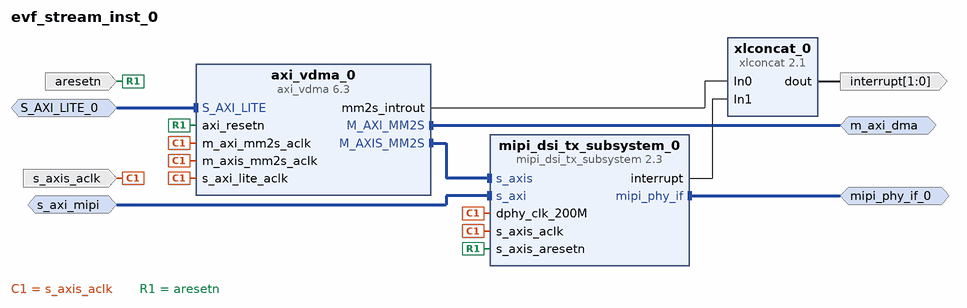
[diagram p0: block diagram of the top level]
# Vivado block design evf_stream_inst_0, xc7z014sclg484-1, Vivado 2023.1
create_bd_design evf_stream_inst_0

create_bd_intf_port -mode Master -vlnv xilinx.com:interface:mipi_phy_rtl:1.0 mipi_phy_if_0
create_bd_intf_port -mode Master -vlnv xilinx.com:interface:aximm_rtl:1.0 m_axi_dma
create_bd_intf_port -mode Slave -vlnv xilinx.com:interface:aximm_rtl:1.0 s_axi_mipi
create_bd_intf_port -mode Slave -vlnv xilinx.com:interface:aximm_rtl:1.0 S_AXI_LITE_0
create_bd_port -dir O -from 1 -to 0 interrupt
create_bd_port -dir I -type rst aresetn
create_bd_port -dir I -type clk s_axis_aclk

create_bd_cell -type ip -vlnv xilinx.com:ip:mipi_dsi_tx_subsystem:2.3 mipi_dsi_tx_subsystem_0
set_property -dict [list \
  CONFIG.C_EN_7S_LINERATE_CHECK true \
  CONFIG.C_EN_HS_OBUFTDS false \
  CONFIG.C_INCLUDE_DCS_CMD_MODE false \
  CONFIG.DPHY_EN_REG_IF false \
  CONFIG.DSI_DATATYPE RGB888 \
  CONFIG.DSI_LANES 4 \
  CONFIG.DSI_PIXELS 4 \
  CONFIG.SupportLevel 1 \
] [get_bd_cells mipi_dsi_tx_subsystem_0]
create_bd_cell -type ip -vlnv xilinx.com:ip:xlconcat:2.1 xlconcat_0
create_bd_cell -type ip -vlnv xilinx.com:ip:axi_vdma:6.3 axi_vdma_0
set_property -dict [list \
  CONFIG.c_include_s2mm 0 \
  CONFIG.c_m_axis_mm2s_tdata_width 96 \
  CONFIG.c_mm2s_genlock_mode 0 \
  CONFIG.c_num_fstores 1 \
] [get_bd_cells axi_vdma_0]

# ---- connections ----

connect_bd_intf_net -intf_net S_AXI_LITE_0_1 [get_bd_intf_ports S_AXI_LITE_0] [get_bd_intf_pins axi_vdma_0/S_AXI_LITE]
connect_bd_intf_net [get_bd_intf_pins axi_vdma_0/M_AXIS_MM2S] [get_bd_intf_pins mipi_dsi_tx_subsystem_0/s_axis]
connect_bd_intf_net [get_bd_intf_ports m_axi_dma] [get_bd_intf_pins axi_vdma_0/M_AXI_MM2S]
connect_bd_intf_net [get_bd_intf_ports mipi_phy_if_0] [get_bd_intf_pins mipi_dsi_tx_subsystem_0/mipi_phy_if]
connect_bd_intf_net -intf_net s_axi_0_1 [get_bd_intf_ports s_axi_mipi] [get_bd_intf_pins mipi_dsi_tx_subsystem_0/s_axi]
connect_bd_net [get_bd_pins axi_vdma_0/mm2s_introut] [get_bd_pins xlconcat_0/In0]
connect_bd_net [get_bd_pins mipi_dsi_tx_subsystem_0/interrupt] [get_bd_pins xlconcat_0/In1]
connect_bd_net -net s_axis_aclk_0_1 [get_bd_ports s_axis_aclk] \
  [get_bd_pins mipi_dsi_tx_subsystem_0/s_axis_aclk] [get_bd_pins axi_vdma_0/s_axi_lite_aclk] \
  [get_bd_pins axi_vdma_0/m_axi_mm2s_aclk] [get_bd_pins axi_vdma_0/m_axis_mm2s_aclk] \
  [get_bd_pins mipi_dsi_tx_subsystem_0/dphy_clk_200M]
connect_bd_net -net s_axis_aresetn_0_1 [get_bd_ports aresetn] [get_bd_pins mipi_dsi_tx_subsystem_0/s_axis_aresetn] [get_bd_pins axi_vdma_0/axi_resetn]
connect_bd_net [get_bd_pins xlconcat_0/dout] [get_bd_ports interrupt]

# ---- address map ----
assign_bd_address -offset 0x00000000 -range 256M -target_address_space [get_bd_addr_spaces axi_vdma_0/Data_MM2S] [get_bd_addr_segs m_axi_dma/Reg]
assign_bd_address -offset 0x40000000 -range 4K -target_address_space [get_bd_addr_spaces S_AXI_LITE_0] [get_bd_addr_segs axi_vdma_0/S_AXI_LITE/Reg]
assign_bd_address -offset 0x43C00000 -range 64K -target_address_space [get_bd_addr_spaces s_axi_mipi] [get_bd_addr_segs mipi_dsi_tx_subsystem_0/s_axi/Reg]

validate_bd_design
save_bd_design
